# Altium schematic sheet Pri_Gate_Driver.SchDoc
size C; SheetNumber: 4; SheetTotal: 5
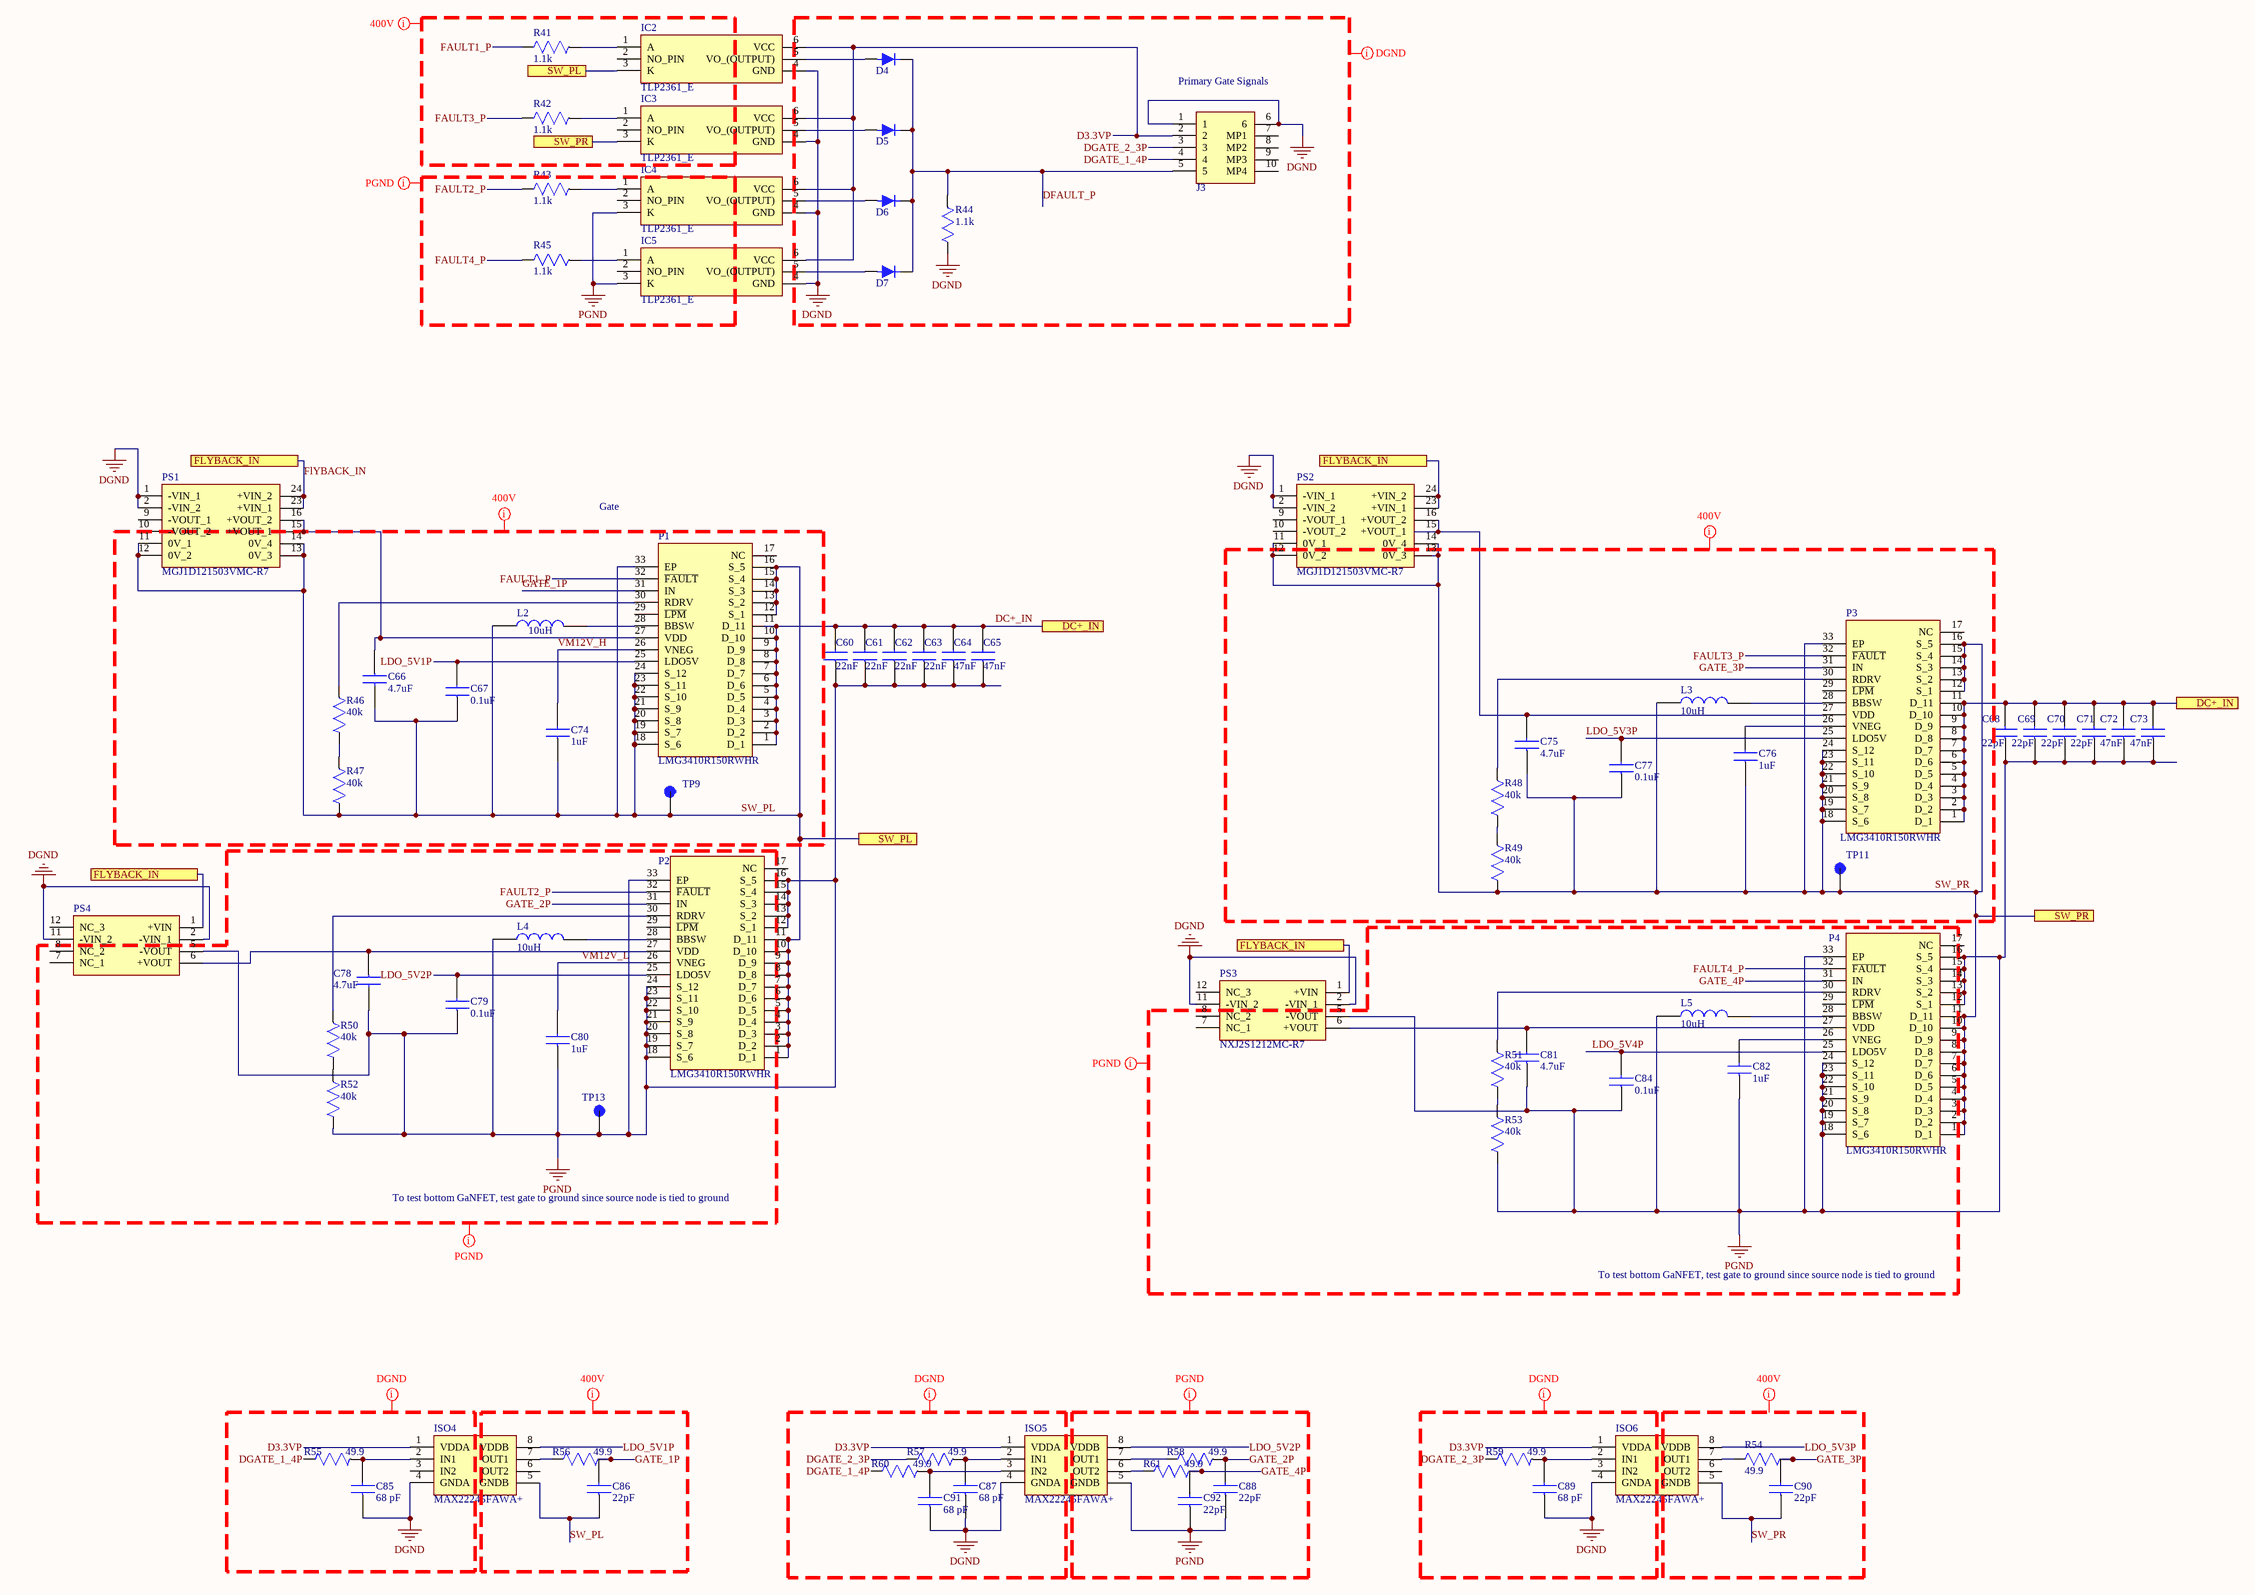
[diagram p0: Pri_Gate_Driver.SchDoc]

## Parts
C60  22nF  [CAPC2012X135N]
C61  22nF  [CAPC2012X135N]
C62  22nF  [CAPC2012X135N]
C63  22nF  [CAPC2012X135N]
C64  47nF  [CAPC2012X135N]
C65  47nF  [CAPC2012X135N]
C66  4.7uF  [CAPC2012X135N]
C67  0.1uF  [CAPC2012X135N]
C68  22pF  [CAPC2012X135N]
C69  22pF  [CAPC2012X135N]
C70  22pF  [CAPC2012X135N]
C71  22pF  [CAPC2012X135N]
C72  47nF  [CAPC2012X135N]
C73  47nF  [CAPC2012X135N]
C74  1uF  [CAPC2012X135N]
C75  4.7uF  [CAPC2012X135N]
C76  1uF  [CAPC2012X135N]
C77  0.1uF  [CAPC2012X135N]
C78  4.7uF  [CAPC2012X135N]
C79  0.1uF  [CAPC2012X135N]
C80  1uF  [CAPC2012X135N]
C81  4.7uF  [CAPC2012X135N]
C82  1uF  [CAPC2012X135N]
C84  0.1uF  [CAPC2012X135N]
C85  68 pF  [CAPC2012X135N]
C86  22pF  [CAPC2012X135N]
C87  68 pF  [CAPC2012X135N]
C88  22pF  [CAPC2012X135N]
C89  68 pF  [CAPC2012X135N]
C90  22pF  [CAPC2012X135N]
C91  68 pF  [CAPC2012X135N]
C92  22pF  [CAPC2012X135N]
D4  CUS520,H3F  [SOD2513X115N]  (value not drawn)
D5  CUS520,H3F  [SOD2513X115N]  (value not drawn)
D6  CUS520,H3F  [SOD2513X115N]  (value not drawn)
D7  CUS520,H3F  [SOD2513X115N]  (value not drawn)
IC2  TLP2361_E  [SOIC127P700X230-6N]
IC3  TLP2361_E  [SOIC127P700X230-6N]
IC4  TLP2361_E  [SOIC127P700X230-6N]
IC5  TLP2361_E  [SOIC127P700X230-6N]
ISO4  MAX22245FAWA+  [SOIC127P1031X265-8N]
ISO5  MAX22245FAWA+  [SOIC127P1031X265-8N]
ISO6  MAX22245FAWA+  [SOIC127P1031X265-8N]
J3  0527450696  [0527450696]  (value not drawn)
L2  10uH  [INDC2012X105N]
L3  10uH  [INDC2012X105N]
L4  10uH  [INDC2012X105N]
L5  10uH  [INDC2012X105N]
P1  LMG3410R150RWHR  [LMG3410R150RWHR]
P2  LMG3410R150RWHR  [LMG3410R150RWHR]
P3  LMG3410R150RWHR  [LMG3410R150RWHR]
P4  LMG3410R150RWHR  [LMG3410R150RWHR]
PS1  MGJ1D121503VMC-R7  [MGJ1D121503VMCR7]
PS2  MGJ1D121503VMC-R7  [MGJ1D121503VMCR7]
PS3  NXJ2S1212MC-R7  [NXJ2S1212MCR7]
PS4  NXJ2S1212MC-R7  [NXJ2S1212MCR7]  (value not drawn)
R41  1.1k  [RESC2012X60N]
R42  1.1k  [RESC2012X60N]
R43  1.1k  [RESC2012X60N]
R44  1.1k  [RESC2012X60N]
R45  1.1k  [RESC2012X60N]
R46  40k  [RESC2012X50N]
R47  40k  [RESC2012X50N]
R48  40k  [RESC2012X50N]
R49  40k  [RESC2012X50N]
R50  40k  [RESC2012X50N]
R51  40k  [RESC2012X50N]
R52  40k  [RESC2012X50N]
R53  40k  [RESC2012X50N]
R54  49.9  [RESC2013X84N]
R55  49.9  [RESC2013X84N]
R56  49.9  [RESC2013X84N]
R57  49.9  [RESC2013X84N]
R58  49.9  [RESC2013X84N]
R59  49.9  [RESC2013X84N]
R60  49.9  [RESC2013X84N]
R61  49.9  [RESC2013X84N]
TP9  Test Point 5011  [TP_5011]  (value not drawn)
TP11  Test Point 5011  [TP_5011]  (value not drawn)
TP13  Test Point 5011  [TP_5011]  (value not drawn)

## Ports
DC+_IN (see Aux_Power[1A], Power_Board[1B], Pri_Gate_Driver[3B]), DC+_IN (see Aux_Power[1A], Power_Board[1B], Pri_Gate_Driver[6B]), FLYBACK_IN (see Aux_Power[5A], Pri_Gate_Driver[1B], Pri_Gate_Driver[1C], Pri_Gate_Driver[4B], Sec_Gate_Driver[1B], Sec_Gate_Driver[1C], Sec_Gate_Driver[3B], Sec_Gate_Driver[3C], Sensing[1B]), FLYBACK_IN (see Aux_Power[5A], Pri_Gate_Driver[1B], Pri_Gate_Driver[1C], Pri_Gate_Driver[4C], Sec_Gate_Driver[1B], Sec_Gate_Driver[1C], Sec_Gate_Driver[3B], Sec_Gate_Driver[3C], Sensing[1B]), FLYBACK_IN (see Aux_Power[5A], Pri_Gate_Driver[1B], Pri_Gate_Driver[4B], Pri_Gate_Driver[4C], Sec_Gate_Driver[1B], Sec_Gate_Driver[1C], Sec_Gate_Driver[3B], Sec_Gate_Driver[3C], Sensing[1B]), FLYBACK_IN (see Aux_Power[5A], Pri_Gate_Driver[1C], Pri_Gate_Driver[4B], Pri_Gate_Driver[4C], Sec_Gate_Driver[1B], Sec_Gate_Driver[1C], Sec_Gate_Driver[3B], Sec_Gate_Driver[3C], Sensing[1B]), SW_PL (see Power_Board[1B], Pri_Gate_Driver[2A]), SW_PL (see Power_Board[1B], Pri_Gate_Driver[3B]), SW_PR (see Power_Board[2C], Pri_Gate_Driver[2A]), SW_PR (see Power_Board[2C], Pri_Gate_Driver[6C])

## Nets
DGND: C85.1 C87.1 C89.1 C91.1 IC2.4(GND) IC3.4(GND) IC4.4(GND) IC5.4(GND) ISO4.4(GNDA) ISO5.4(GNDA) ISO6.4(GNDA) J3.1 J3.6 PS1.1(-VIN_1) PS1.2(-VIN_2) PS2.1(-VIN_1) PS2.2(-VIN_2) PS3.2(-VIN_1) PS3.11(-VIN_2) PS4.2(-VIN_1) PS4.11(-VIN_2) R44.1
PGND: C60.1 C61.1 C62.1 C63.1 C64.1 C65.1 C68.1 C69.1 C70.1 C71.1 C72.1 C73.1 C78.2 C79.1 C80.1 C81.1 C82.1 C84.1 C88.1 C92.1 IC4.3(K) IC5.3(K) ISO5.5(GNDB) L4.1 L5.1 P2.12(S_1) P2.13(S_2) P2.14(S_3) P2.15(S_4) P2.16(S_5) P2.18(S_6) P2.19(S_7) P2.20(S_8) P2.21(S_9) P2.22(S_10) P2.23(S_11) P2.24(S_12) P2.33(EP) P4.12(S_1) P4.13(S_2) P4.14(S_3) P4.15(S_4) P4.16(S_5) P4.18(S_6) P4.19(S_7) P4.20(S_8) P4.21(S_9) P4.22(S_10) P4.23(S_11) P4.24(S_12) P4.33(EP) PS3.5(-VOUT) PS4.5(-VOUT) R52.1 R53.1 TP13.1
D3.3VP: IC2.6(VCC) IC3.6(VCC) IC4.6(VCC) IC5.6(VCC) ISO4.1(VDDA) ISO5.1(VDDA) ISO6.1(VDDA) J3.2
DC+_IN: C60.2 C61.2 C62.2 C63.2 C64.2 C65.2 C68.2 C69.2 C70.2 C71.2 C72.2 C73.2 P1.1(D_1) P1.2(D_2) P1.3(D_3) P1.4(D_4) P1.5(D_5) P1.6(D_6) P1.7(D_7) P1.8(D_8) P1.9(D_9) P1.10(D_10) P1.11(D_11) P3.1(D_1) P3.2(D_2) P3.3(D_3) P3.4(D_4) P3.5(D_5) P3.6(D_6) P3.7(D_7) P3.8(D_8) P3.9(D_9) P3.10(D_10) P3.11(D_11) ; port DC+_IN
DFAULT_P: D4.2 D5.2 D6.2 D7.2 J3.5 R44.2
DGATE_1_4P: J3.4 R55.1 R60.1
DGATE_2_3P: J3.3 R57.1 R59.1
FAULT1_P: P1.32(~{FAULT}) R41.1
FAULT2_P: P2.32(~{FAULT}) R43.1
FAULT3_P: P3.32(~{FAULT}) R42.1
FAULT4_P: P4.32(~{FAULT}) R45.1
FlYBACK_IN: PS1.23(+VIN_1) PS1.24(+VIN_2) PS2.23(+VIN_1) PS2.24(+VIN_2) PS3.1(+VIN) PS4.1(+VIN) ; port FLYBACK_IN
GATE_1P: C86.2 P1.31(IN) R56.2
GATE_2P: C88.2 P2.31(IN) R58.2
GATE_3P: C90.2 P3.31(IN) R54.2
GATE_4P: C92.2 P4.31(IN) R61.2
LDO_5V1P: C67.2 ISO4.8(VDDB) P1.25(LDO5V)
LDO_5V2P: C79.2 ISO5.8(VDDB) P2.25(LDO5V)
LDO_5V3P: C77.2 ISO6.8(VDDB) P3.25(LDO5V)
LDO_5V4P: C84.2 P4.25(LDO5V)
SW_PL: C66.2 C67.1 C74.1 C86.1 IC2.3(K) ISO4.5(GNDB) L2.1 P1.12(S_1) P1.13(S_2) P1.14(S_3) P1.15(S_4) P1.16(S_5) P1.18(S_6) P1.19(S_7) P1.20(S_8) P1.21(S_9) P1.22(S_10) P1.23(S_11) P1.24(S_12) P1.33(EP) P2.1(D_1) P2.2(D_2) P2.3(D_3) P2.4(D_4) P2.5(D_5) P2.6(D_6) P2.7(D_7) P2.8(D_8) P2.9(D_9) P2.10(D_10) P2.11(D_11) PS1.11(0V_1) PS1.12(0V_2) PS1.13(0V_3) PS1.14(0V_4) R47.1 TP9.1 ; port SW_PL
SW_PR: C75.1 C76.1 C77.1 C90.1 IC3.3(K) ISO6.5(GNDB) L3.1 P3.12(S_1) P3.13(S_2) P3.14(S_3) P3.15(S_4) P3.16(S_5) P3.18(S_6) P3.19(S_7) P3.20(S_8) P3.21(S_9) P3.22(S_10) P3.23(S_11) P3.24(S_12) P3.33(EP) P4.1(D_1) P4.2(D_2) P4.3(D_3) P4.4(D_4) P4.5(D_5) P4.6(D_6) P4.7(D_7) P4.8(D_8) P4.9(D_9) P4.10(D_10) P4.11(D_11) PS2.11(0V_1) PS2.12(0V_2) PS2.13(0V_3) PS2.14(0V_4) R49.1 TP11.1 ; port SW_PR
VM12V_H: C74.2 P1.26(VNEG)
VM12V_L: C80.2 P2.26(VNEG)
NetC66_1: C66.1 P1.27(VDD) PS1.15(+VOUT_1) PS1.16(+VOUT_2)
NetC75_2: C75.2 P3.27(VDD) PS2.15(+VOUT_1) PS2.16(+VOUT_2)
NetC76_2: C76.2 P3.26(VNEG)
NetC78_1: C78.1 P2.27(VDD) PS4.6(+VOUT)
NetC81_2: C81.2 P4.27(VDD) PS3.6(+VOUT)
NetC82_2: C82.2 P4.26(VNEG)
NetC85_2: C85.2 ISO4.2(IN1) R55.2
NetC87_2: C87.2 ISO5.2(IN1) R57.2
NetC89_2: C89.2 ISO6.2(IN1) R59.2
NetC91_2: C91.2 ISO5.3(IN2) R60.2
NetD4_1: D4.1 IC2.5(VO_(OUTPUT))
NetD5_1: D5.1 IC3.5(VO_(OUTPUT))
NetD6_1: D6.1 IC4.5(VO_(OUTPUT))
NetD7_1: D7.1 IC5.5(VO_(OUTPUT))
NetIC2_1: IC2.1(A) R41.2
NetIC3_1: IC3.1(A) R42.2
NetIC4_1: IC4.1(A) R43.2
NetIC5_1: IC5.1(A) R45.2
NetISO4_7: ISO4.7(OUT1) R56.1
NetISO5_6: ISO5.6(OUT2) R61.1
NetISO5_7: ISO5.7(OUT1) R58.1
NetISO6_7: ISO6.7(OUT1) R54.1
NetL2_2: L2.2 P1.28(BBSW)
NetL3_2: L3.2 P3.28(BBSW)
NetL4_2: L4.2 P2.28(BBSW)
NetL5_2: L5.2 P4.28(BBSW)
NetP1_30: P1.30(RDRV) R46.2
NetP2_30: P2.30(RDRV) R50.2
NetP3_30: P3.30(RDRV) R48.2
NetP4_30: P4.30(RDRV) R51.2
NetR46_1: R46.1 R47.2
NetR48_1: R48.1 R49.2
NetR50_1: R50.1 R52.2
NetR51_1: R51.1 R53.2

Not connected (* = marked no-connect by the designer): IC2 2(NO_PIN); IC3 2(NO_PIN); IC4 2(NO_PIN); IC5 2(NO_PIN); ISO4 3(IN2) 6(OUT2); ISO6 3(IN2) 6(OUT2); J3 7(MP1) 8(MP2) 9(MP3) 10(MP4); P1 17(NC) 29(~{LPM}); P2 17(NC) 29(~{LPM}); P3 17(NC) 29(~{LPM}); P4 17(NC) 29(~{LPM}); PS1 9(-VOUT_1) 10(-VOUT_2); PS2 9(-VOUT_1) 10(-VOUT_2); PS3 7(NC_1) 8(NC_2) 12(NC_3); PS4 7(NC_1) 8(NC_2) 12(NC_3)

## Layout directives
net class 400V: FAULT1_P, FAULT3_P, GATE_1P, GATE_3P, LDO_5V1P, LDO_5V3P, SW_PL, SW_PR, VM12V_H
net class PGND: FAULT2_P, FAULT4_P, GATE_2P, GATE_4P, LDO_5V2P, LDO_5V4P, PGND, VM12V_L
net class DGND: D3.3VP, DFAULT_P, DGATE_1_4P, DGATE_2_3P, DGND

## Notes on the sheet
- (near J3) Primary Gate Signals
- Gate
- To test bottom GaNFET, test gate to ground since source node is tied to ground

## Library data of the parts
C60-C63 = C0805C223KCRACTU: CAP CER 0.022UF 500V X7R 0805; Manufacturer_Name: KEMET; Datasheet Link: https://content.kemet.com/datasheets/KEM_C1010_X7R_HV_SMD.pdf; Height: 1.1mm; Manufacturer_Part_Number: C0805C223KCRACTU; Mouser Part Number: 80-C0805C223KCRACTU; Mouser Price/Stock: https://www.mouser.co.uk/ProductDetail/KEMET/C0805C223KCRACTU?qs=B0TNOcbsrWfBRUwBirn3HQ%3D%3D
C64 C65 C72 C73 = C2012X7T2W473K125AA: CAP CER 47NF 450V X7T 0805; Manufacturer_Name: TDK; Datasheet Link: https://product.tdk.com/info/en/catalog/datasheets/mlcc_commercial_midvoltage_en.pdf; Height: 1.45mm; Manufacturer_Part_Number: C2012X7T2W473K125AA; Mouser Part Number: 810-C2012X7T2W473KAA; Mouser Price/Stock: https://www.mouser.co.uk/ProductDetail/TDK/C2012X7T2W473K125AA?qs=U4gclJHtfSgknEmuhwNeZw%3D%3D
C66 C78 = GRM21BR61H475KE51L: Capacitor; Manufacturer_Name: Murata Electronics; Datasheet Link: https://search.murata.co.jp/Ceramy/image/img/A01X/G101/ENG/GRM21BR61H475KE51-01A.pdf; Height: 1.45mm; Manufacturer_Part_Number: GRM21BR61H475KE51L; Mouser Part Number: 81-GRM21BR61H475KE1L; Mouser Price/Stock: https://www.mouser.co.uk/ProductDetail/Murata-Electronics/GRM21BR61H475KE51L?qs=eeBpzGFlv%252B%252BOtLzDC1PY6Q%3D%3D; Arrow Part Number: GRM21BR61H475KE51L; Arrow Price/Stock: https://www.arrow.com/en/products/grm21br61h475ke51l/murata-manufacturing?region=nac
C67 C77 C79 C84 = CL21B104KCFNNNE: CAP CER 0.1UF 100V X7R 0805; Manufacturer_Name: SAMSUNG; Datasheet Link: https://datasheet.datasheetarchive.com/originals/distributors/DKDS-19/374389.pdf; Height: 1.35mm; Manufacturer_Part_Number: CL21B104KCFNNNE; Mouser Part Number: 187-CL21B104KCFNNNE; Mouser Price/Stock: https://www.mouser.co.uk/ProductDetail/Samsung-Electro-Mechanics/CL21B104KCFNNNE?qs=lptGheUA4EwiEGVRX9oguw%3D%3D; Arrow Part Number: CL21B104KCFNNNE; Arrow Price/Stock: https://www.arrow.com/en/products/cl21b104kcfnnne/samsung-electro-mechanics?region=europe
C68-C71 C86 C88 C90 C92 = C0805C220J1GACTU: CAP CER 22PF 100V C0G/NP0 0805; Manufacturer_Name: KEMET; Datasheet Link: https://content.kemet.com/datasheets/KEM_C1003_C0G_SMD.pdf; Height: 1.1mm; Manufacturer_Part_Number: C0805C220J1GACTU; Mouser Part Number: 80-C0805C220J1G; Mouser Price/Stock: https://www.mouser.co.uk/ProductDetail/KEMET/C0805C220J1GACTU?qs=43LhqrlLHAWrlSFTo8H45g%3D%3D; Arrow Part Number: C0805C220J1GACTU; Arrow Price/Stock: https://www.arrow.com/en/products/c0805c220j1gactu/kemet-corporation
C74 = C0805C105K3RACTU: Capacitor; Manufacturer_Name: KEMET; Datasheet Link: https://content.kemet.com/datasheets/KEM_C1002_X7R_SMD.pdf; Height: 1.1mm; Manufacturer_Part_Number: C0805C105K3RACTU; Mouser Part Number: 80-C0805C105K3R; Mouser Price/Stock: https://www.mouser.co.uk/ProductDetail/KEMET/C0805C105K3RACTU?qs=7V%2FSUxyM1Kfm2X%2FN09twSA%3D%3D; Arrow Part Number: C0805C105K3RACTU; Arrow Price/Stock: https://www.arrow.com/en/products/c0805c105k3ractu/kemet-corporation?region=nac
C75 C81 = GRM21BR61H475KE51L: CAP CER 4.7UF 50V X5R 0805; Manufacturer_Name: Murata Electronics; Datasheet Link: https://search.murata.co.jp/Ceramy/image/img/A01X/G101/ENG/GRM21BR61H475KE51-01A.pdf; Height: 1.45mm; Manufacturer_Part_Number: GRM21BR61H475KE51L; Mouser Part Number: 81-GRM21BR61H475KE1L; Mouser Price/Stock: https://www.mouser.co.uk/ProductDetail/Murata-Electronics/GRM21BR61H475KE51L?qs=eeBpzGFlv%252B%252BOtLzDC1PY6Q%3D%3D; Arrow Part Number: GRM21BR61H475KE51L; Arrow Price/Stock: https://www.arrow.com/en/products/grm21br61h475ke51l/murata-manufacturing?region=nac
C76 C80 C82 = C0805C105K3RACTU: CAP CER 1UF 25V X7R 0805; Manufacturer_Name: KEMET; Datasheet Link: https://content.kemet.com/datasheets/KEM_C1002_X7R_SMD.pdf; Height: 1.1mm; Manufacturer_Part_Number: C0805C105K3RACTU; Mouser Part Number: 80-C0805C105K3R; Mouser Price/Stock: https://www.mouser.co.uk/ProductDetail/KEMET/C0805C105K3RACTU?qs=7V%2FSUxyM1Kfm2X%2FN09twSA%3D%3D; Arrow Part Number: C0805C105K3RACTU; Arrow Price/Stock: https://www.arrow.com/en/products/c0805c105k3ractu/kemet-corporation?region=nac
C85 C87 C89 C91 = C0805C680J5GACTU: CAP CER 68PF 50V C0G/NP0 0805; Manufacturer_Name: KEMET; Datasheet Link: https://content.kemet.com/datasheets/KEM_C1003_C0G_SMD.pdf; Height: 1.1mm; Manufacturer_Part_Number: C0805C680J5GACTU; Mouser Part Number: 80-C0805C680J5G; Mouser Price/Stock: https://www.mouser.co.uk/ProductDetail/KEMET/C0805C680J5GACTU?qs=6TVATEUodcRQxIollGm9Gg%3D%3D
D4-D7 = CUS520,H3F: DIODE SCHOTTKY 30V 200MA USC; Manufacturer_Name: onsemi; Manufacturer_Part_Number: MMSD4148T1G; Datasheet Link: https://www.onsemi.com/pub/Collateral/MMSD4148T1-D.PDF; Height: 1.35mm; Mouser Part Number: 863-MMSD4148T1G; Mouser Price/Stock: https://www.mouser.co.uk/ProductDetail/onsemi/MMSD4148T1G?qs=P4IOph%252Bbot9zwOmK%2F4hkww%3D%3D; Arrow Part Number: MMSD4148T1G; Arrow Price/Stock: https://www.arrow.com/en/products/mmsd4148t1g/on-semiconductor?utm_currency=USD&region=europe
IC2-IC5 = TLP2361_E: Integrated Circuit; Manufacturer_Name: Toshiba; Manufacturer_Part_Number: TLP2361(E; Datasheet Link: https://toshiba.semicon-storage.com/info/docget.jsp?did=14229&prodName=TLP2361; Height: 2.3mm; Mouser Part Number: 757-TLP2361(E; Mouser Price/Stock: https://www.mouser.co.uk/ProductDetail/Toshiba/TLP2361E?qs=HVbQlW5zcXW54RRsl7V%2FMQ%3D%3D; Arrow Part Number: TLP2361(E; Arrow Price/Stock: https://www.arrow.com/en/products/tlp2361-e/toshiba?utm_currency=USD&region=nac
ISO4-ISO6 = MAX22245FAWA+: DG ISO 5KV 2CH CAN/RS232 8-SOIC; Manufacturer_Name: Analog Devices; Datasheet Link: https://datasheets.maximintegrated.com/en/ds/MAX22245-MAX22246.pdf; Height: 2.65mm; Manufacturer_Part_Number: MAX22245FAWA+
J3 = 0527450696: CONN FFC FPC TOP 6POS 0.5MM R/A; Manufacturer_Name: Molex; Datasheet Link: https://www.molex.com/content/dam/molex/molex-dot-com/products/automated/en-us/salesdrawingpdf/527/52745/527450696_sd.pdf?inline; Height: 2mm; Manufacturer_Part_Number: 0527450696; Mouser Part Number: N/A; Mouser Price/Stock: https://www.mouser.co.uk/ProductDetail/Molex/0527450696?qs=PBcRNPEHKspDQteIzUIw7A%3D%3D; Arrow Part Number: 0527450696; Arrow Price/Stock: null?region=nac
L2 = MLZ2012N100LT000: Inductor; Manufacturer_Name: TDK; Datasheet Link: https://product.tdk.com/system/files/dam/doc/product/inductor/inductor/smd/catalog/inductor_commercial_decoupling_mlz2012_en.pdf; Height: 1.05mm; Manufacturer_Part_Number: MLZ2012N100LT000; Mouser Part Number: 810-MLZ2012N100LT000; Mouser Price/Stock: https://www.mouser.co.uk/ProductDetail/TDK/MLZ2012N100LT000?qs=%2FPzWLGNeQ%252BhBF9df2MjAZQ%3D%3D; Arrow Part Number: MLZ2012N100LT000; Arrow Price/Stock: https://www.arrow.com/en/products/mlz2012n100lt000/tdk?region=nac
L3-L5 = MLZ2012N100LT000: FIXED IND 10UH 500MA 300MOHM SMD; Manufacturer_Name: TDK; Datasheet Link: https://product.tdk.com/system/files/dam/doc/product/inductor/inductor/smd/catalog/inductor_commercial_decoupling_mlz2012_en.pdf; Height: 1.05mm; Manufacturer_Part_Number: MLZ2012N100LT000; Mouser Part Number: 810-MLZ2012N100LT000; Mouser Price/Stock: https://www.mouser.co.uk/ProductDetail/TDK/MLZ2012N100LT000?qs=%2FPzWLGNeQ%252BhBF9df2MjAZQ%3D%3D; Arrow Part Number: MLZ2012N100LT000; Arrow Price/Stock: https://www.arrow.com/en/products/mlz2012n100lt000/tdk?region=nac
P1 P3 P4 = LMG3410R150RWHR: SMART 150MOHM GAN FET WITH DRIVE; Manufacturer_Name: Texas Instruments; Datasheet Link: http://www.ti.com/lit/ds/symlink/lmg3411r150.pdf; Height: 0.9mm; Manufacturer_Part_Number: LMG3410R150RWHR; Mouser Part Number: 595-LMG3410R150RWHR; Mouser Price/Stock: https://www.mouser.co.uk/ProductDetail/Texas-Instruments/LMG3410R150RWHR?qs=mAH9sUMRCtsIKfdPif%2F5dw%3D%3D
P2 = LMG3410R150RWHR: Integrated Circuit; Manufacturer_Name: Texas Instruments; Datasheet Link: http://www.ti.com/lit/ds/symlink/lmg3411r150.pdf; Height: 0.9mm; Manufacturer_Part_Number: LMG3410R150RWHR; Mouser Part Number: 595-LMG3410R150RWHR; Mouser Price/Stock: https://www.mouser.co.uk/ProductDetail/Texas-Instruments/LMG3410R150RWHR?qs=mAH9sUMRCtsIKfdPif%2F5dw%3D%3D
PS1 = MGJ1D121503VMC-R7: Power Supply; Manufacturer_Name: Murata Electronics; Datasheet Link: https://www.murata.com.cn/products/productdata/8826773962782/KDC-MGJ1V.pdf?1720063814000; Height: 4.95mm; Manufacturer_Part_Number: MGJ1D121503VMC-R7; Mouser Part Number: 580-MGJ1D121503VMCR7; Mouser Price/Stock: https://www.mouser.co.uk/ProductDetail/Murata-Power-Solutions/MGJ1D121503VMC-R7?qs=IKkN%2F947nfAXIvidLatSTQ%3D%3D
PS2 = MGJ1D121503VMC-R7: DC DC CONVERTER 15V -3V 1W; Manufacturer_Name: Murata Electronics; Datasheet Link: https://www.murata.com.cn/products/productdata/8826773962782/KDC-MGJ1V.pdf?1720063814000; Height: 4.95mm; Manufacturer_Part_Number: MGJ1D121503VMC-R7; Mouser Part Number: 580-MGJ1D121503VMCR7; Mouser Price/Stock: https://www.mouser.co.uk/ProductDetail/Murata-Power-Solutions/MGJ1D121503VMC-R7?qs=IKkN%2F947nfAXIvidLatSTQ%3D%3D
PS3 PS4 = NXJ2S1212MC-R7: DC DC CONVERTER 12V 2W; Manufacturer_Name: Murata Electronics; Datasheet Link: https://www.mouser.com/datasheet/2/281/kdc_nxj2-1368015.pdf; Height: 4.86mm; Manufacturer_Part_Number: NXJ2S1212MC-R7; Mouser Part Number: 580-NXJ2S1212MC-R7; Mouser Price/Stock: https://www.mouser.co.uk/ProductDetail/Murata-Power-Solutions/NXJ2S1212MC-R7?qs=MLItCLRbWswcHTaOUWcyaw%3D%3D; Arrow Part Number: NXJ2S1212MC-R7; Arrow Price/Stock: https://www.arrow.com/en/products/nxj2s1212mc-r7/murata-power-solutions
R41-R45 = RMCF0805JT1K10: RES 1.1K OHM 5% 1/8W 0805; Manufacturer_Name: Panasonic; Manufacturer_Part_Number: ERJ-PB6B1002V; Datasheet Link: https://componentsearchengine.com/Datasheets/1/ERJ-PB6B1002V.pdf; Height: 0.7mm; Mouser Part Number: 667-ERJ-PB6B1002V; Mouser Price/Stock: https://www.mouser.co.uk/ProductDetail/Panasonic/ERJ-PB6B1002V?qs=eFOtW6xYNWFfvuWzLzq%2FIQ%3D%3D; Arrow Part Number: ERJ-PB6B1002V; Arrow Price/Stock: https://www.arrow.com/en/products/erj-pb6b1002v/panasonic?region=nac
R46-R53 = RT0603BRD0740KL: RES 40K OHM 0.1% 1/10W 0603; Manufacturer_Name: YAGEO; Datasheet Link: https://www.yageo.com/upload/media/product/app/datasheet/rchip/pyu-rt_1-to-0.01_rohs_l.pdf; Height: 0.55mm; Manufacturer_Part_Number: RT0603BRD0740KL; Mouser Part Number: 603-RT0603BRD0740KL; Mouser Price/Stock: https://www.mouser.co.uk/ProductDetail/YAGEO/RT0603BRD0740KL?qs=gt1LBUVyoHlX7zH8R4KgIw%3D%3D; Arrow Part Number: RT0603BRD0740KL; Arrow Price/Stock: https://www.arrow.com/en/products/rt0603brd0740kl/yageo?region=nac
R54-R61 = PCAN0805E49R9BST5: RES SMD 49.9 OHM 0.1% 1W 0805; Manufacturer_Name: Vishay; Datasheet Link: https://altium.componentsearchengine.com/Datasheets/1/PCAN0805E49R9BST5.pdf; Height: 0.838mm; Manufacturer_Part_Number: PCAN0805E49R9BST5; Mouser Part Number: 71-PCAN0805E49R9BST5; Mouser Price/Stock: https://www.mouser.co.uk/ProductDetail/Vishay-Thin-Film/PCAN0805E49R9BST5?qs=0KABoAvMNWeDPZ7%2F3japZQ%3D%3D
TP9 TP11 TP13 = Test Point 5011: MP: altium_native_batch; Value: *; Availability: Unavailable; Price: None; Package: None